# Altium schematic sheet conn_rotary_control_out.SchDoc
size A
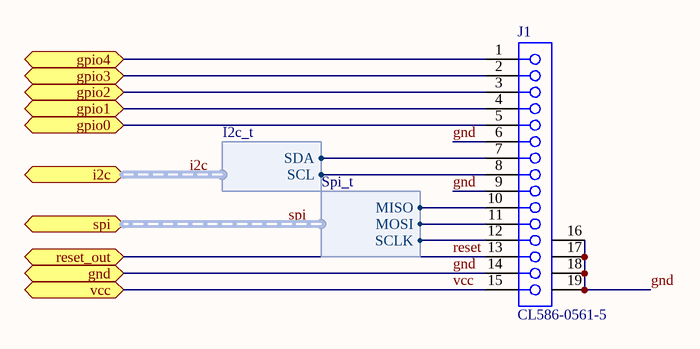
[diagram p0: conn_rotary_control_out.SchDoc]

## Parts
J1  CL586-0561-5  [FH12-15S-0.5SV]

## Ports
gnd, gpio0, gpio1, gpio2, gpio3, gpio4, i2c (harness I2c_t), reset_out, spi (harness Spi_t), vcc

## Harnesses
Spi_t: MISO, MOSI, SCLK
I2c_t: SCL, SDA

## Nets
gnd: J1.6 J1.9 J1.14 J1.16(MH1) J1.17(MH2) J1.18(MH3) J1.19(MH4) ; port gnd
gpio0: J1.5 ; port gpio0
gpio1: J1.4 ; port gpio1
gpio2: J1.3 ; port gpio2
gpio3: J1.2 ; port gpio3
gpio4: J1.1 ; port gpio4
i2c.SCL: J1.8 ; port i2c.SCL
i2c.SDA: J1.7 ; port i2c.SDA
reset: J1.13 ; port reset_out
spi.MISO: J1.10 ; port spi.MISO
spi.MOSI: J1.11 ; port spi.MOSI
spi.SCLK: J1.12 ; port spi.SCLK
vcc: J1.15 ; port vcc

## Buses and harness runs
harness i2c = port i2c
harness spi = port spi

## Library data of the parts
J1 = CL586-0561-5: FH12 Series, "Flip-Lock" SMT/ZIF FFC/FPC Connector - 0.5mm Spaced Vertical Mounting; Manufacturer: Hirose; ManufacturerPartNumber: FH12-15S-0.5SV(55); Positions: 15; ContactMaterial: Phosphor Bronze; Current: 0.4A; PCB_Layout: Complies with manufacturer's recommendation.; Note: Pad dimensions follow nominal values, Suitable for Wave Soldering, Adjust for Re-flow.; Published: 17-Jul-2002; DatasheetVersion: 13-Nov-2000; PackageVersion: 13-Nov-2000; PackageReference: FH12-15S-0.5SV; Publisher: Altium Limited; ComponentLink1Description: Manufacturer Link; ComponentLink1URL: http://www.hiroseusa.com/; ComponentLink2Description: Datasheet; ComponentLink2URL: http://www.hirose.co.jp/cataloge_hp/e58605370.pdf